# Altium schematic sheet DigitalLabBoard_Switches.SchDoc
size A4
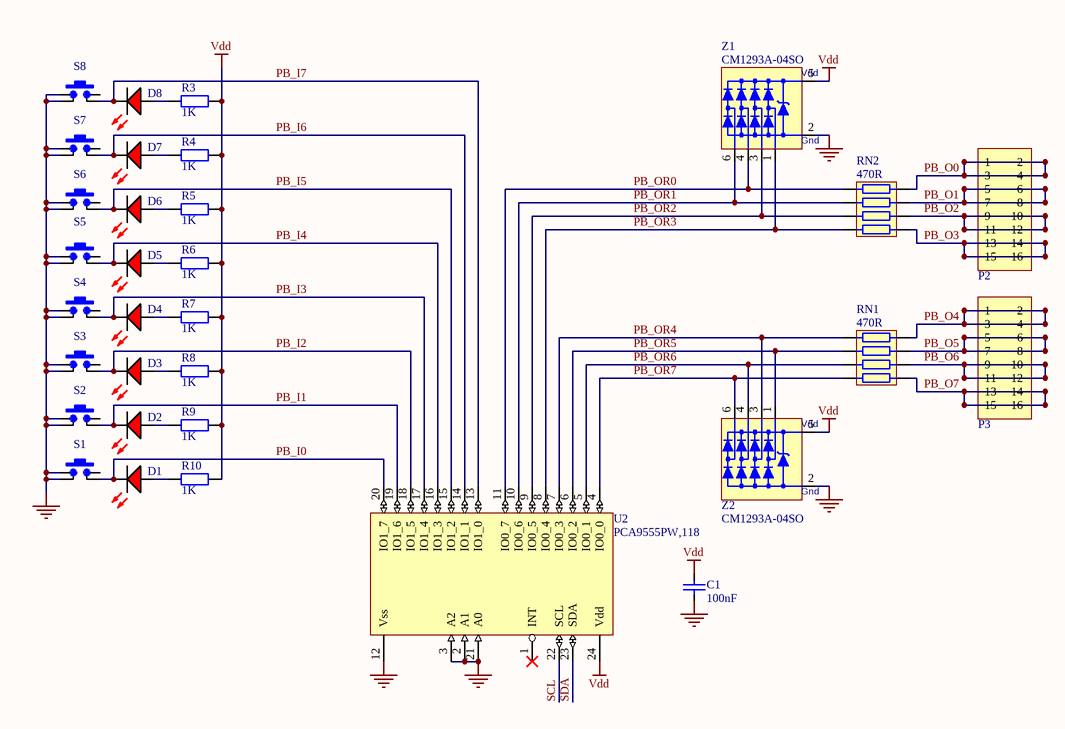
[diagram p0: DigitalLabBoard_Switches.SchDoc]

## Parts
C1  100nF  [CCNP1608-0603]
D1  LED Red  [LED1608-0603-RED]  (value not drawn)
D2  LED Red  [LED1608-0603-RED]  (value not drawn)
D3  LED Red  [LED1608-0603-RED]  (value not drawn)
D4  LED Red  [LED1608-0603-RED]  (value not drawn)
D5  LED Red  [LED1608-0603-RED]  (value not drawn)
D6  LED Red  [LED1608-0603-RED]  (value not drawn)
D7  LED Red  [LED1608-0603-RED]  (value not drawn)
D8  LED Red  [LED1608-0603-RED]  (value not drawn)
P2  Header 2x8  [HDR2X8S]  (value not drawn)
P3  Header 2x8  [HDR2X8S]  (value not drawn)
R3  1K  [CR1608-0603]
R4  1K  [CR1608-0603]
R5  1K  [CR1608-0603]
R6  1K  [CR1608-0603]
R7  1K  [CR1608-0603]
R8  1K  [CR1608-0603]
R9  1K  [CR1608-0603]
R10  1K  [CR1608-0603]
RN1  470R  [CR1206-0603_X4_N]
RN2  470R  [CR1206-0603_X4_N]
S1  SMD-SW-4_5.1x5.1x2.0_M  [SMD-SW-4_5.1x5.1x2.0_M]  (value not drawn)
S2  SMD-SW-4_5.1x5.1x2.0_M  [SMD-SW-4_5.1x5.1x2.0_M]  (value not drawn)
S3  SMD-SW-4_5.1x5.1x2.0_M  [SMD-SW-4_5.1x5.1x2.0_M]  (value not drawn)
S4  SMD-SW-4_5.1x5.1x2.0_M  [SMD-SW-4_5.1x5.1x2.0_M]  (value not drawn)
S5  SMD-SW-4_5.1x5.1x2.0_M  [SMD-SW-4_5.1x5.1x2.0_M]  (value not drawn)
S6  SMD-SW-4_5.1x5.1x2.0_M  [SMD-SW-4_5.1x5.1x2.0_M]  (value not drawn)
S7  SMD-SW-4_5.1x5.1x2.0_M  [SMD-SW-4_5.1x5.1x2.0_M]  (value not drawn)
S8  SMD-SW-4_5.1x5.1x2.0_M  [SMD-SW-4_5.1x5.1x2.0_M]  (value not drawn)
U2  PCA9555PW,118  [TSSOP24_N]
Z1  CM1293A-04SO  [SOT457_N]
Z2  CM1293A-04SO  [SOT457_N]

## Nets
GND: C1.1 S1.1 S1.1b S2.1 S2.1b S3.1 S3.1b S4.1 S4.1b S5.1 S5.1b S6.1 S6.1b S7.1 S7.1b S8.1 S8.1b U2.2(A1) U2.3(A2) U2.12(Vss) U2.21(A0) Z1.2(Vn) Z2.2(Vn)
Vdd: C1.2 R3.2 R4.2 R5.2 R6.2 R7.2 R8.2 R9.2 R10.2 U2.24(Vdd) Z1.5(Vp) Z2.5(Vp)
PB_I0: D1.K S1.2 U2.20(IO1_7)
PB_I1: D2.K S2.2 U2.19(IO1_6)
PB_I2: D3.K S3.2 U2.18(IO1_5)
PB_I3: D4.K S4.2 U2.17(IO1_4)
PB_I4: D5.K S5.2 U2.16(IO1_3)
PB_I5: D6.K S6.2 U2.15(IO1_2)
PB_I6: D7.K S7.2 U2.14(IO1_1)
PB_I7: D8.K S8.2 U2.13(IO1_0)
PB_O0: P2.1 P2.2 P2.3 P2.4 RN2.4
PB_O1: P2.5 P2.6 P2.7 P2.8 RN2.3
PB_O2: P2.9 P2.10 P2.11 P2.12 RN2.2
PB_O3: P2.13 P2.14 P2.15 P2.16 RN2.1
PB_O4: P3.1 P3.2 P3.3 P3.4 RN1.4
PB_O5: P3.5 P3.6 P3.7 P3.8 RN1.3
PB_O6: P3.9 P3.10 P3.11 P3.12 RN1.2
PB_O7: P3.13 P3.14 P3.15 P3.16 RN1.1
PB_OR0: RN2.5 U2.11(IO0_7) Z1.4
PB_OR1: RN2.6 U2.10(IO0_6) Z1.6
PB_OR2: RN2.7 U2.9(IO0_5) Z1.3
PB_OR3: RN2.8 U2.8(IO0_4) Z1.1
PB_OR4: RN1.5 U2.7(IO0_3) Z2.3
PB_OR5: RN1.6 U2.6(IO0_2) Z2.1
PB_OR6: RN1.7 U2.5(IO0_1) Z2.4
PB_OR7: RN1.8 U2.4(IO0_0) Z2.6
SCL: U2.22(SCL)
SDA: U2.23(SDA)
NetD1_A: D1.A R10.1
NetD2_A: D2.A R9.1
NetD3_A: D3.A R8.1
NetD4_A: D4.A R7.1
NetD5_A: D5.A R6.1
NetD6_A: D6.A R5.1
NetD7_A: D7.A R4.1
NetD8_A: D8.A R3.1

Not connected (* = marked no-connect by the designer): S1 2b; S2 2b; S3 2b; S4 2b; S5 2b; S6 2b; S7 2b; S8 2b; U2 1(INT)*

## Notes on the sheet
- (in symbol CM1293A-04SO) Vdd; Gnd

## Library data of the parts
C1 = Cap_CCNP_0603: Capacitor non-polar SMT 0603; Manufacturer: Generic Components; Class: Passive; Published: 08/06/2000; Publisher: Altium Hobart Technology Centre; SubClass: Capacitor; Farnell PN: *; Digikey: *; Value: 100nF; LCSC: C14663
D1-D8 = LED-0603-Red: LED 0603 Red; Manufacturer: Generic Components; Class I: Optoelectronic; Published: 8-Jun-2000; Revision: July-2002: Re-released for DXP Platform.; Publisher: Altium Limited; Class II: LED; Farnell PN: 1581239; Digikey: *; LCSC: C2286
R3-R10 = Res_CR0603: Resistor SMT 0603; Manufacturer: Generic Components; Class: Passive; Published: 08/06/2000; Publisher: Altium Hobart Technology Centre; SubClass: Resistor; Farnell PN: *; Digikey: *; Value: 1K; LCSC: C21190
RN1 RN2 = ResistorNetwork_CR0603x4: SMT x4 Resistor Array; Value: 470 ohm; Farnell PN: *; Digikey: *; LCSC: C25510
S1-S8 = SW_PB-TS: Tactile Switch SPST 5.10mm X 5.10mm / (1.5mm=C318884) / (2.0mm=C318888) / (3.5mm=C318886); Revision: 1.0; LCSC: C318888
U2 = PCA9555PW,118: 16-bit I2C I/O Expander (TSSOP24) / PUPs on I/O pins; Farnell PN: 2101299; Digikey: 568-1058-1-ND; LCSC: C128392
Z1 Z2 = CM1293A-04SO: Ultra low capacitance quadruple rail-to-rail ESD protection; Farnell PN: 2533258; Digikey: CM1293A-04SOOSCT-ND; LCSC: C393377
P2 P3 = Header 2x8: Digikey: 609-5704-ND; Parameter 2: *